# Altium project SSOP-TSSOP20.PrjPCB
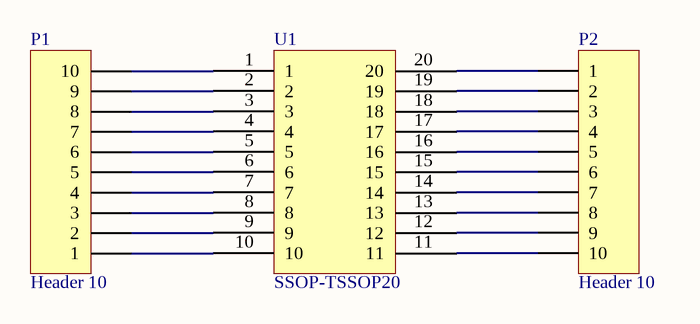
[diagram p0: SSOP-TSSOP20.SchDoc]
1 sheet, 3 parts. Net scope: global (net labels, ports and power ports of the same name join across sheets).
Board file: SSOP-TSSOP20.PcbDoc

## Sheet SSOP-TSSOP20.SchDoc
size B

### Parts
P1  Header 10  [HDR1X10]
P2  Header 10  [HDR1X10]
U1  SSOP-TSSOP20  [SSOP-TSSOP20]

### Nets
NetP1_1: P1.1 U1.10
NetP1_2: P1.2 U1.9
NetP1_3: P1.3 U1.8
NetP1_4: P1.4 U1.7
NetP1_5: P1.5 U1.6
NetP1_6: P1.6 U1.5
NetP1_7: P1.7 U1.4
NetP1_8: P1.8 U1.3
NetP1_9: P1.9 U1.2
NetP1_10: P1.10 U1.1
NetP2_1: P2.1 U1.20
NetP2_2: P2.2 U1.19
NetP2_3: P2.3 U1.18
NetP2_4: P2.4 U1.17
NetP2_5: P2.5 U1.16
NetP2_6: P2.6 U1.15
NetP2_7: P2.7 U1.14
NetP2_8: P2.8 U1.13
NetP2_9: P2.9 U1.12
NetP2_10: P2.10 U1.11

### Library data of the parts
P1 P2 = Header 10: Header, 10-Pin; LatestRevisionDate: 17-Jul-2002; LatestRevisionNote: Re-released for DXP Platform.; Publisher: Altium Limited